# EAGLE design CD-i (EAGLE 9.6.2)
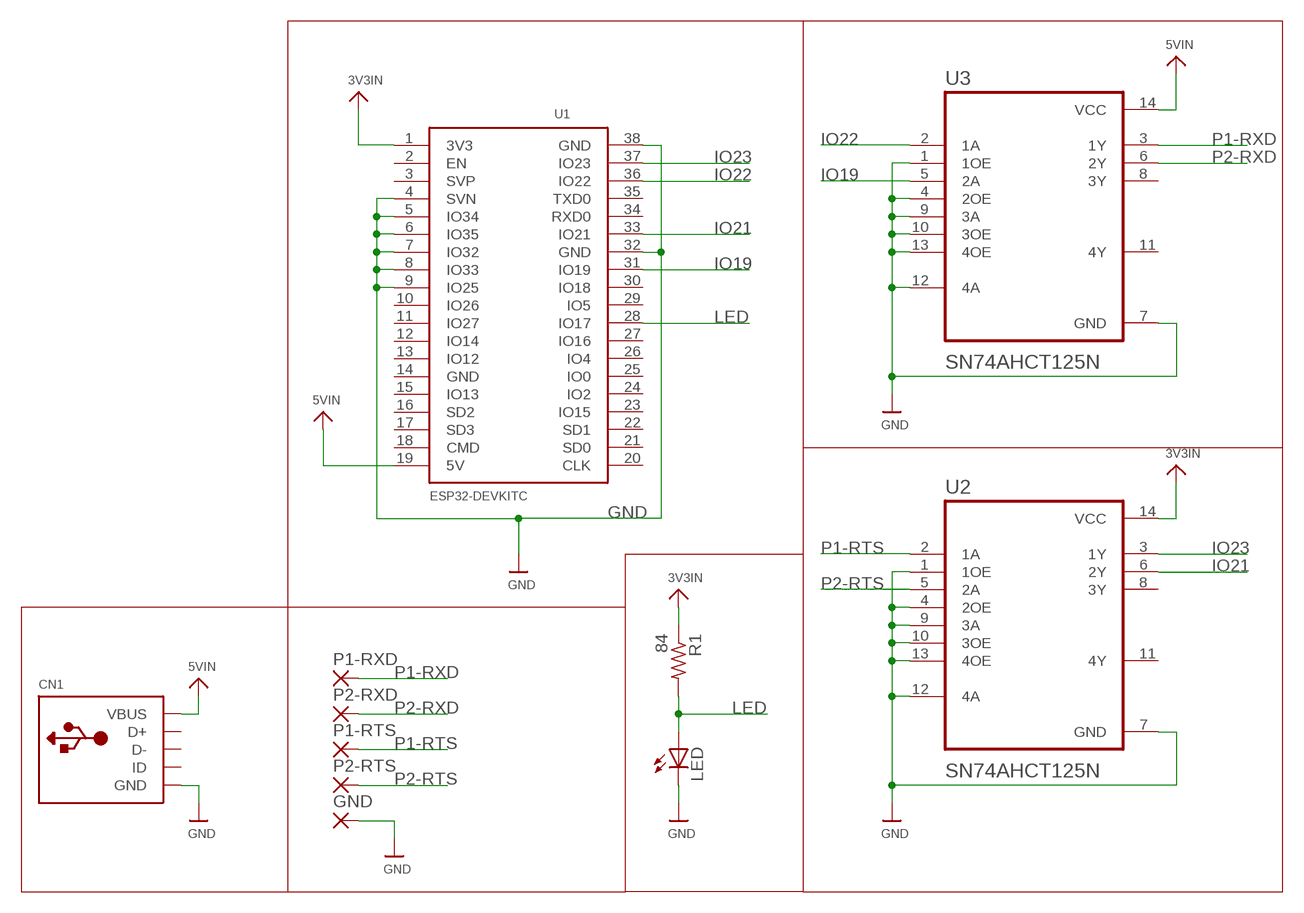
[diagram p0: schematic, sheet 1]

## Parts
CN1  USBTHM  [USB-MINIB-THM]
GND  SMD5  [SMD2,54-5,08]
LED  LEDCHIPLED_1206  [CHIPLED_1206]
P1-RTS  SMD5  [SMD2,54-5,08]
P1-RXD  SMD5  [SMD2,54-5,08]
P2-RTS  SMD5  [SMD2,54-5,08]
P2-RXD  SMD5  [SMD2,54-5,08]
R1  84  R-US_R1206  [R1206]
U1  ESP32DEVKITC  [ESP32-DEVKITC]
U2  SN74AHCT125N  [DIP794W45P254L1969H508Q14]
U3  SN74AHCT125N  [DIP794W45P254L1969H508Q14]

## Nets
3V3IN: R1.1 U1.1(3V3) U2.14(VCC)
5VIN: CN1.VBUS U1.19(5V) U3.14(VCC)
GND: CN1.GND GND.1(P) LED.C U1.4(SVN) U1.5(IO34) U1.6(IO35) U1.7(IO32) U1.8(IO33) U1.9(IO25) U1.32(GND) U1.38(GND) U2.1(1OE) U2.4(2OE) U2.7(GND) U2.9(3A) U2.10(3OE) U2.12(4A) U2.13(4OE) U3.1(1OE) U3.4(2OE) U3.7(GND) U3.9(3A) U3.10(3OE) U3.12(4A) U3.13(4OE)
IO19: U1.31(IO19) U3.5(2A)
IO21: U1.33(IO21) U2.6(2Y)
IO22: U1.36(IO22) U3.2(1A)
IO23: U1.37(IO23) U2.3(1Y)
LED: LED.A R1.2 U1.28(IO17)
P1-RTS: P1-RTS.1(P) U2.2(1A)
P1-RXD: P1-RXD.1(P) U3.3(1Y)
P2-RTS: P2-RTS.1(P) U2.5(2A)
P2-RXD: P2-RXD.1(P) U3.6(2Y)
Unconnected: CN1.D+ CN1.D- CN1.ID U1.2(EN) U1.3(SVP) U1.10(IO26) U1.11(IO27) U1.12(IO14) U1.13(IO12) U1.14(GND) U1.15(IO13) U1.16(SD2) U1.17(SD3) U1.18(CMD) U1.20(CLK) U1.21(SD0) U1.22(SD1) U1.23(IO15) U1.24(IO2) U1.25(IO0) U1.26(IO4) U1.27(IO16) U1.29(IO5) U1.30(IO18) U1.34(RXD0) U1.35(TXD0) U2.8(3Y) U2.11(4Y) U3.8(3Y) U3.11(4Y)

## Library data of the parts
CN1 = adafruit:USB: USB Connectors USBMINIB - Surface Mount Female Mini-B USB Connector 4UConnector: 06564 By microbuilder.eu Thru-hole RA Female Mini-B USB Connector 4UConnector: 18732 By ladyada.net
GND P1-RTS P1-RXD P2-RTS P2-RXD = wirepad:SMD5: SMD PAD
LED = adafruit:LED: LED OSRAM: - CHIPLED LG R971, LG N971, LY N971, LG Q971, LY Q971, LO R971, LY R971 LH N974, LH R974 LS Q976, LO Q976, LY Q976 LO Q996 - Hyper CHIPLED LW Q18S LB Q993, LB Q99A, LB R99A - SideLED LS A670, LO A670, LY A670, LG A670, LP A670 LB A673, LV A673, LT A673, LW A673 LH A674 LY A675 LS A676, LA A676, LO A676, LY A676, LW A676 LS A679, LY A679, LG A679 - Hyper Micro SIDELED® LS Y876, LA Y876, LO Y876, LY Y876 LT Y87S - SmartLED LW L88C, LW L88S LB L89C, LB L89S, LG L890 LS L89K, LO L89K, LY L89K LS L896, LA L896, LO L896, LY L896 - TOPLED LS T670, LO T670, LY T670, LG T670, LP T670 LSG T670, LSP T670, LSY T670, LOP T670, LYG T670 LG T671, LOG T671, LSG T671 LB T673, LV T673, LT T673, LW T673 LH T674 LS T676, LA T676, LO T676, LY T676, LB T676, LH T676, LSB T676, LW T676 LB T67C, LV T67C, LT T67C, LS T67K, LO T67K, LY T67K, LW E67C LS E67B, LA E67B, LO E67B, LY E67B, LB E67C, LV E67C, LT E67C LW T67C LS T679, LY T679, LG T679 LS T770, LO T770, LY T770, LG T770, LP T770 LB T773, LV T773, LT T773, LW T773 LH T774 LS E675, LA E675, LY E675, LS T675 LS T776, LA T776, LO T776, LY T776, LB T776 LHGB T686 LT T68C, LB T68C - Hyper Mini TOPLED® LB M676 - Mini TOPLED Santana® LG M470 LS M47K, LO M47K, LY M47K Source: http://www.osram.convergy.de/
R1 = adafruit:R-US_: RESISTOR, American symbol
U1 = ESP32-DEVKITC:ESP32DEVKITC
U2 U3 = SN74AHCT125N:SN74AHCT125N: None Check prices <https://pricing.snapeda.com/parts/SN74AHCT125N/Texas%20Instruments/view-part?ref=eda>; AVAILABILITY: In Stock; DESCRIPTION: Quadruple Bus Buffer Gates With 3-State Outputs 14-PDIP -40 to 125; MF: Texas Instruments; MP: SN74AHCT125N; PACKAGE: PDIP-14 Texas Instruments; PRICE: None; PURCHASE-URL: https://pricing.snapeda.com/search/part/SN74AHCT125N/?ref=eda

## Board
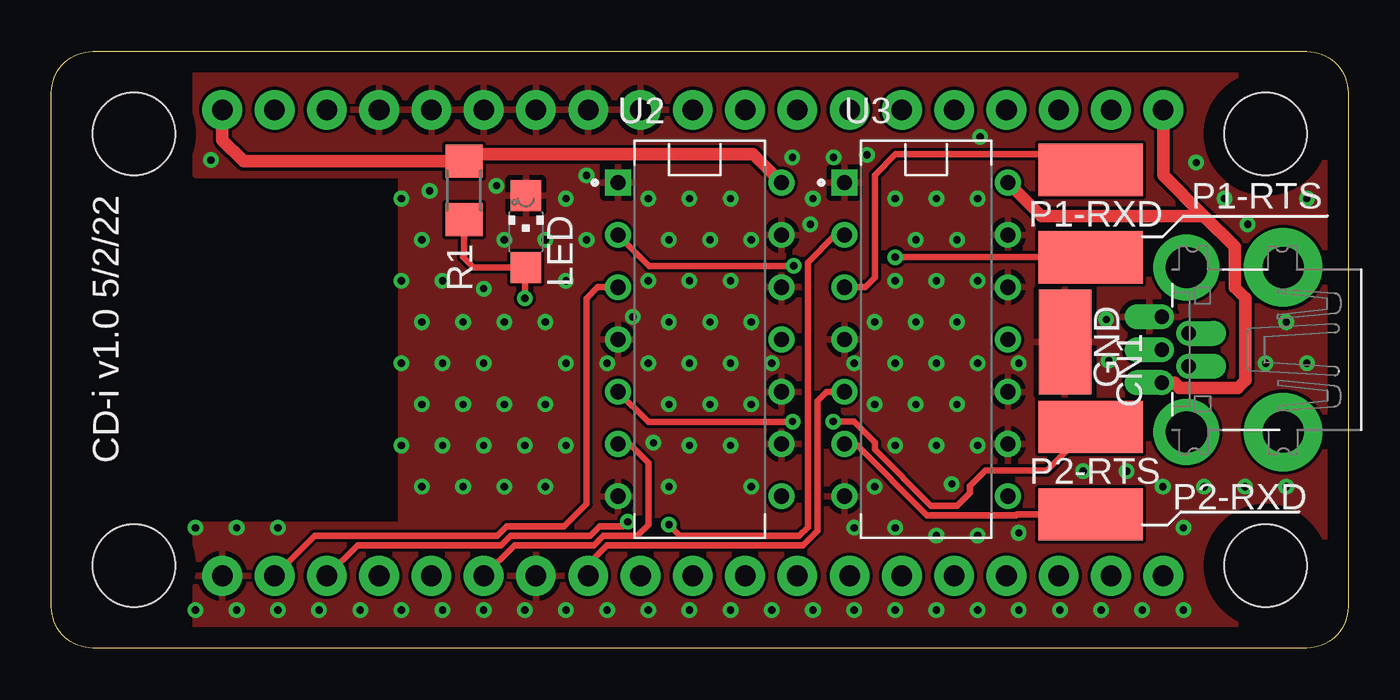
[diagram p1: board, top side]
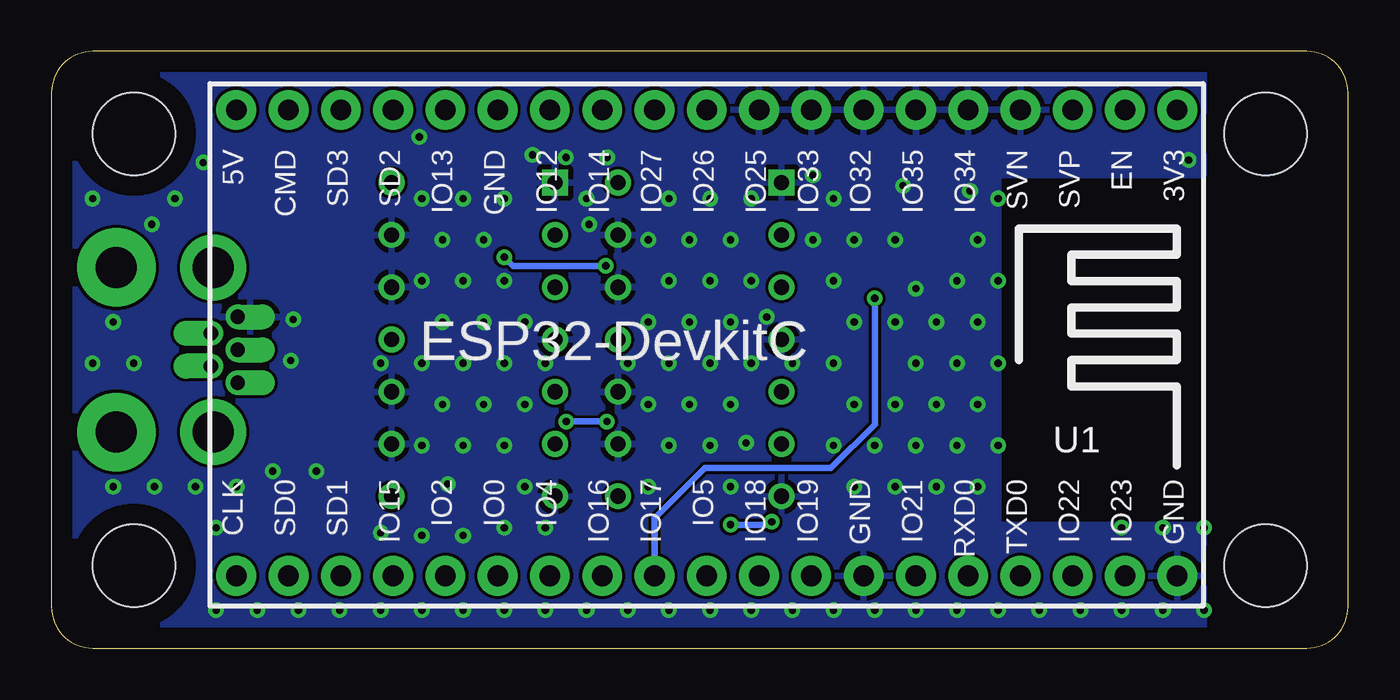
[diagram p2: board, bottom side, seen from below]

Size 63 x 29 mm. Coordinates in mm from the lower left corner, seen from the top.
Outline: 0,2 0,27 arc-90 2,29 61,29 arc-90 63,27 63,2 arc-90 61,0 2,0 arc-90 0,2
Copper layers (1*16): Top 0.035mm / dielectric 1.5mm / Bottom 0.035mm
Design rules "default": minimum track width 6mil, minimum drill 0.35mm, track to track 6mil, track to pad 6mil, pad to pad 6mil, via to via 6mil, smd to smd 6mil, copper to edge 40mil, drill to drill 6mil, minimum pad ring 10mil, minimum via ring 8mil, stop-mask expansion 4mil, vias tented up to drill 0.5mm, thermal gap 10mil
Holes 4 mm at 4,4 4,25 59,25 59,4

### Footprints (pad centres in the part's own frame; a part is rotated, then mirrored left to right if it is on the bottom)
USB-MINIB-THM = drill 0.7 offset: D+ 0,9.8; D- -0.8,8.5; GND 1.6,9.8; ID 0.8,8.5; VBUS -1.6,9.8 | drill 2 pad 3.81: GND1 -4,3.9; GND4 4,3.9 | drill 2 pad 3.2: GND2 -4,8.6; GND3 4,8.6
SMD2,54-5,08 = smd 2.54 x 5.08: 1 0,0
CHIPLED_1206 = smd 1.5 x 1.5: A 0,-1.75; C 0,1.75
R1206 = smd 1.6 x 1.803: 1 -1.422,0; 2 1.422,0
ESP32-DEVKITC = drill 1 pad 1.93: 1 -22.87,-11.42; 2 -20.33,-11.42; 3 -17.79,-11.42; 4 -15.25,-11.42; 5 -12.71,-11.42; 6 -10.17,-11.42; 7 -7.63,-11.42; 8 -5.09,-11.42; 9 -2.55,-11.42; 10 -0.01,-11.42; 11 2.53,-11.42; 12 5.07,-11.42; 13 7.61,-11.42; 14 10.15,-11.42; 15 12.69,-11.42; 16 15.23,-11.42; 17 17.77,-11.42; 18 20.31,-11.42; 19 22.85,-11.42; 20 22.85,11.23; 21 20.31,11.23; 22 17.77,11.23; 23 15.23,11.23; 24 12.69,11.23; 25 10.15,11.23; 26 7.61,11.23; 27 5.07,11.23; 28 2.53,11.23; 29 -0.01,11.23; 30 -2.55,11.23; 31 -5.09,11.23; 32 -7.63,11.23; 33 -10.17,11.23; 34 -12.71,11.23; 35 -15.25,11.23; 36 -17.79,11.23; 37 -20.33,11.23; 38 -22.87,11.23
DIP794W45P254L1969H508Q14 = drill 0.74 pad 1.14 square: 1 -3.97,7.62 | drill 0.74 pad 1.14: 2 -3.97,5.08; 3 -3.97,2.54; 4 -3.97,0; 5 -3.97,-2.54; 6 -3.97,-5.08; 7 -3.97,-7.62; 8 3.97,-7.62; 9 3.97,-5.08; 10 3.97,-2.54; 11 3.97,0; 12 3.97,2.54; 13 3.97,5.08; 14 3.97,7.62

### Placement (x,y rotation side)
CN1  63.75,14.5 90 top
GND  49.25,14.88 180 top
LED  23.05,20.24 0 top
P1-RTS  50.5,19 90 top
P1-RXD  50.5,23.25 90 top
P2-RTS  50.5,10.75 90 top
P2-RXD  50.5,6.5 90 top
R1  20.05,22.24 270 top
U1  31.17,14.74 180 bottom
U2  31.5,15 0 top
U3  42.5,15 0 top

### Tracks (layer width: path | path; a pad name or v marks a point on that pad's centre or on a via)
3V3IN
  Top 0.61: U1.1 8.3,24.7 9.34,23.66 R1.1 20.39,24 34.09,24 U2.14
5VIN
  Top 0.61: CN1.VBUS 54.55,12.9 54.81,12.64 57.64,12.64 58,13 58,17.01 57.49,17.52 57.49,19.51 56,21 | U1.19 54.02,22.98 56,21 | U3.14 48.09,21 56,21
GND  (via drill 0.35)
  other vias: 7,1.85 7,5.85 9,1.85 9,5.85 7.75,23.72 11,1.85 11,5.85 13,1.85 15,1.85 17,1.85 17,9.85 17,13.85 17,17.85 17,21.85 19,1.85 18,7.85 19,9.85 18,11.85 19,13.85 18,15.85 19,17.85 18,19.85 18.38,22.22 21,1.85 20,7.85 21,9.85 20,11.85 21,13.85 20,15.85 21,17.47 26,22.97 21.62,22.47 23,1.85 22,7.85 23,9.85 22,11.85 22,15.85 22,19.85 25,1.85 24,7.85 25,9.85 24,11.85 25,13.85 24,15.85 25,17.85 24,19.85 25,21.85 27,1.85 27,13.85 26,19.85 29,1.85 29.25,9.97 29,13.85 28.25,16.1 29,17.85 29,21.85 31,1.85 30,7.85 31,9.85 30,11.85 31,13.85 30,15.85 31,17.85 30,19.85 31,21.85 33,1.85 33,9.85 32,11.85 33,13.85 32,15.85 33,17.85 32,19.85 33,21.85 35,1.85 34,7.85 34,11.85 35,13.85 34,15.85 34,19.85 37,1.85 36.88,20.6 37,21.85 36,23.85 39,1.85 39,5.85 39,13.85 38,23.85 41,1.85 41,5.85 40,7.85 41,9.85 40,11.85 41,13.85 40,15.85 41,17.85 41,21.85 39.62,23.97 43,1.85 43,5.47 43,9.85 42,11.85 43,13.85 42,15.85 43,17.85 42,19.85 43,21.85 45,1.85 45,5.47 43.75,7.97 45,9.85 44,11.85 45,13.85 44,15.85 45,17.85 44,19.85 45,21.85 45.12,24.85 47,1.85 47,5.6 47,13.85 51.25,15.97 49,1.85 51,1.85 51.38,13.97 53,1.85 55,1.85 55,5.85 54,7.85 56,7.85 50.12,8.6 57,21.85 55.62,23.6 58,7.85 52.25,8.6 59,13.85 58.12,20.6 60,7.85 61,13.85 60,15.85 61,21.85
  pour Top: 7,29 7,23 17,23 17,6 7,6 7,0 63,0 63,29
  pour Bottom: 7,0 63,0 63,29 7,29 7,23 17,23 17,6 7,6
IO19
  Top 0.305: U1.31 26.08,4.08 27,5 36.52,5 37.21,5.69 37.21,12 37.67,12.46 U3.5
IO21
  Top 0.305: U1.33 22.49,5 26.35,5 26.81,5.46 28.46,5.46 29,6 29,9 28.08,9.92 U2.6
IO22  (via drill 0.35)
  Top 0.305: U1.36 14.87,5 21.84,5 22.3,5.46 26.16,5.46 26.62,5.91 27.77,5.91 v28,6.14 | v30,6 30.54,5.46 36.33,5.46 36.75,5.88 36.75,18.75 38.08,20.08 U3.2
  Bottom 0.305: v28,6.14 28.14,6 v30,6
IO23
  Top 0.305: U1.37 12.79,5.46 21.65,5.46 22.11,5.91 24.91,5.91 26,7 26,17 26.54,17.54 U2.3
LED  (via drill 0.35)
  Top 0.305: v23,17 23,18.44 LED.A 20.51,18.49 20,19 20.05,19.05 R1.2
  Bottom 0.305: U1.28 33.7,6.3 31.25,8.75 25.12,8.75 23,10.88 v23,17
P1-RTS  (via drill 0.35)
  Top 0.305: U2.2 29.03,18.58 v36.07,18.58 | v41,19 P1-RTS.1
  Bottom 0.305: v36.07,18.58 40.58,18.58 v41,19
P1-RXD
  Top 0.305: U3.3 39.54,17.54 40,18 40,23 41,24 49.75,24 P1-RXD.1
P2-RTS  (via drill 0.35)
  Top 0.305: U2.5 29,11 v36,11 v36.01,11.01 | v37.99,11.01 38.99,11.01 40,10 40,9.65 42.74,6.91 44,6.91 44.62,7.53 44.62,7.88 45.38,8.62 48.38,8.62 P2-RTS.1
  Bottom 0.305: v36.01,11.01 v37.99,11.01
P2-RXD
  Top 0.305: U3.6 39.08,9.92 42.55,6.45 46.85,6.45 46.9,6.5 P2-RXD.1

### Text on the board
tNames: CD-i v1.0 5/2/22